# Altium project BIO26_hall_strip.PrjPcb
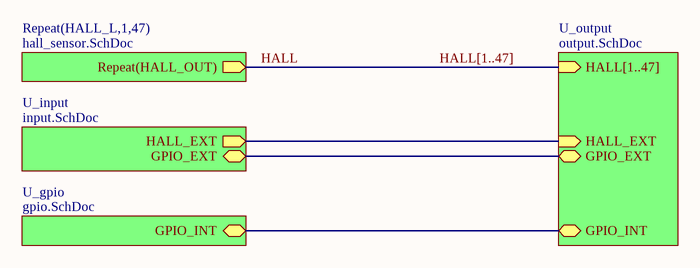
[diagram p0: hall_strip.SchDoc]
5 sheets, 100 parts. Net scope: hierarchical (ports join the sheet entries above them; power ports are global).
Board file: hall_strip.PcbDoc
Sheets:
  hall_strip.SchDoc
    HALL_L1 = hall_sensor.SchDoc
    HALL_L2 = hall_sensor.SchDoc
    HALL_L3 = hall_sensor.SchDoc
    HALL_L4 = hall_sensor.SchDoc
    HALL_L5 = hall_sensor.SchDoc
    HALL_L6 = hall_sensor.SchDoc
    HALL_L7 = hall_sensor.SchDoc
    HALL_L8 = hall_sensor.SchDoc
    HALL_L9 = hall_sensor.SchDoc
    HALL_L10 = hall_sensor.SchDoc
    HALL_L11 = hall_sensor.SchDoc
    HALL_L12 = hall_sensor.SchDoc
    HALL_L13 = hall_sensor.SchDoc
    HALL_L14 = hall_sensor.SchDoc
    HALL_L15 = hall_sensor.SchDoc
    HALL_L16 = hall_sensor.SchDoc
    HALL_L17 = hall_sensor.SchDoc
    HALL_L18 = hall_sensor.SchDoc
    HALL_L19 = hall_sensor.SchDoc
    HALL_L20 = hall_sensor.SchDoc
    HALL_L21 = hall_sensor.SchDoc
    HALL_L22 = hall_sensor.SchDoc
    HALL_L23 = hall_sensor.SchDoc
    HALL_L24 = hall_sensor.SchDoc
    HALL_L25 = hall_sensor.SchDoc
    HALL_L26 = hall_sensor.SchDoc
    HALL_L27 = hall_sensor.SchDoc
    HALL_L28 = hall_sensor.SchDoc
    HALL_L29 = hall_sensor.SchDoc
    HALL_L30 = hall_sensor.SchDoc
    HALL_L31 = hall_sensor.SchDoc
    HALL_L32 = hall_sensor.SchDoc
    HALL_L33 = hall_sensor.SchDoc
    HALL_L34 = hall_sensor.SchDoc
    HALL_L35 = hall_sensor.SchDoc
    HALL_L36 = hall_sensor.SchDoc
    HALL_L37 = hall_sensor.SchDoc
    HALL_L38 = hall_sensor.SchDoc
    HALL_L39 = hall_sensor.SchDoc
    HALL_L40 = hall_sensor.SchDoc
    HALL_L41 = hall_sensor.SchDoc
    HALL_L42 = hall_sensor.SchDoc
    HALL_L43 = hall_sensor.SchDoc
    HALL_L44 = hall_sensor.SchDoc
    HALL_L45 = hall_sensor.SchDoc
    HALL_L46 = hall_sensor.SchDoc
    HALL_L47 = hall_sensor.SchDoc
    U_output = output.SchDoc
    U_input = input.SchDoc
    U_gpio = gpio.SchDoc

## Sheet hall_strip.SchDoc
size A4

### Sub-sheets
Repeat(HALL_L,1,47) = hall_sensor.SchDoc: Repeat(HALL_OUT) (out)
U_gpio = gpio.SchDoc: GPIO_INT (bidir)
U_input = input.SchDoc: HALL_EXT (out), GPIO_EXT (bidir)
U_output = output.SchDoc: HALL[1..47] (in), GPIO_EXT (bidir), GPIO_INT (bidir), HALL_EXT (in)

### Nets
GPIO_EXT: sheet U_output/GPIO_EXT, sheet U_input/GPIO_EXT
GPIO_INT: sheet U_output/GPIO_INT, sheet U_gpio/GPIO_INT
HALL: sheet Repeat(HALL_L,1,47)/Repeat(HALL_OUT)
HALL_EXT: sheet U_output/HALL_EXT, sheet U_input/HALL_EXT

### Buses and harness runs
bus HALL[1..47] =  = sheet U_output/HALL[1..47]

## Sheet hall_sensor.SchDoc
size A4
Used 47 times, as channels HALL_L1, HALL_L2, HALL_L3, HALL_L4, HALL_L5, HALL_L6, HALL_L7, HALL_L8, HALL_L9, HALL_L10, HALL_L11, HALL_L12, HALL_L13, HALL_L14, HALL_L15, HALL_L16, HALL_L17, HALL_L18, HALL_L19, HALL_L20, HALL_L21, HALL_L22, HALL_L23, HALL_L24, HALL_L25, HALL_L26, HALL_L27, HALL_L28, HALL_L29, HALL_L30, HALL_L31, HALL_L32, HALL_L33, HALL_L34, HALL_L35, HALL_L36, HALL_L37, HALL_L38, HALL_L39, HALL_L40, HALL_L41, HALL_L42, HALL_L43, HALL_L44, HALL_L45, HALL_L46, HALL_L47. Parts and nets are listed once, with the designators drawn on the sheet.
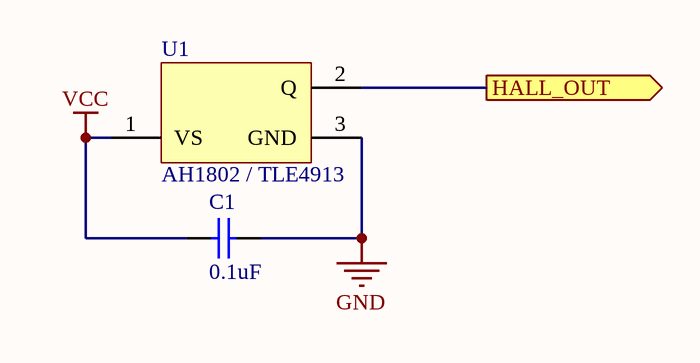
[diagram p1: hall_sensor.SchDoc]

### Parts
C1  0.1uF  [CAPC1608X87X35NL15T15]
U1  AH1802 / TLE4913  [INF-PG-SC59_M]

### Ports
HALL_OUT (out)

### Nets
GND: C1.2 U1.3(GND)
VCC: C1.1 U1.1(VS)
HALL_OUT: U1.2(Q) ; port HALL_OUT

### Channels
HALL_L1: designators end in _HALL_L1; ports HALL_OUT=HALL1
HALL_L2: designators end in _HALL_L2; ports HALL_OUT=HALL1
HALL_L3: designators end in _HALL_L3; ports HALL_OUT=HALL1
HALL_L4: designators end in _HALL_L4; ports HALL_OUT=HALL1
HALL_L5: designators end in _HALL_L5; ports HALL_OUT=HALL1
HALL_L6: designators end in _HALL_L6; ports HALL_OUT=HALL1
HALL_L7: designators end in _HALL_L7; ports HALL_OUT=HALL1
HALL_L8: designators end in _HALL_L8; ports HALL_OUT=HALL1
HALL_L9: designators end in _HALL_L9; ports HALL_OUT=HALL1
HALL_L10: designators end in _HALL_L10; ports HALL_OUT=HALL1
HALL_L11: designators end in _HALL_L11; ports HALL_OUT=HALL1
HALL_L12: designators end in _HALL_L12; ports HALL_OUT=HALL1
HALL_L13: designators end in _HALL_L13; ports HALL_OUT=HALL1
HALL_L14: designators end in _HALL_L14; ports HALL_OUT=HALL1
HALL_L15: designators end in _HALL_L15; ports HALL_OUT=HALL1
HALL_L16: designators end in _HALL_L16; ports HALL_OUT=HALL1
HALL_L17: designators end in _HALL_L17; ports HALL_OUT=HALL1
HALL_L18: designators end in _HALL_L18; ports HALL_OUT=HALL1
HALL_L19: designators end in _HALL_L19; ports HALL_OUT=HALL1
HALL_L20: designators end in _HALL_L20; ports HALL_OUT=HALL1
HALL_L21: designators end in _HALL_L21; ports HALL_OUT=HALL1
HALL_L22: designators end in _HALL_L22; ports HALL_OUT=HALL1
HALL_L23: designators end in _HALL_L23; ports HALL_OUT=HALL1
HALL_L24: designators end in _HALL_L24; ports HALL_OUT=HALL1
HALL_L25: designators end in _HALL_L25; ports HALL_OUT=HALL1
HALL_L26: designators end in _HALL_L26; ports HALL_OUT=HALL1
HALL_L27: designators end in _HALL_L27; ports HALL_OUT=HALL1
HALL_L28: designators end in _HALL_L28; ports HALL_OUT=HALL1
HALL_L29: designators end in _HALL_L29; ports HALL_OUT=HALL1
HALL_L30: designators end in _HALL_L30; ports HALL_OUT=HALL1
HALL_L31: designators end in _HALL_L31; ports HALL_OUT=HALL1
HALL_L32: designators end in _HALL_L32; ports HALL_OUT=HALL1
HALL_L33: designators end in _HALL_L33; ports HALL_OUT=HALL1
HALL_L34: designators end in _HALL_L34; ports HALL_OUT=HALL1
HALL_L35: designators end in _HALL_L35; ports HALL_OUT=HALL1
HALL_L36: designators end in _HALL_L36; ports HALL_OUT=HALL1
HALL_L37: designators end in _HALL_L37; ports HALL_OUT=HALL1
HALL_L38: designators end in _HALL_L38; ports HALL_OUT=HALL1
HALL_L39: designators end in _HALL_L39; ports HALL_OUT=HALL1
HALL_L40: designators end in _HALL_L40; ports HALL_OUT=HALL1
HALL_L41: designators end in _HALL_L41; ports HALL_OUT=HALL1
HALL_L42: designators end in _HALL_L42; ports HALL_OUT=HALL1
HALL_L43: designators end in _HALL_L43; ports HALL_OUT=HALL1
HALL_L44: designators end in _HALL_L44; ports HALL_OUT=HALL1
HALL_L45: designators end in _HALL_L45; ports HALL_OUT=HALL1
HALL_L46: designators end in _HALL_L46; ports HALL_OUT=HALL1
HALL_L47: designators end in _HALL_L47; ports HALL_OUT=HALL1

### Library data of the parts
C1 = CMP-2006-03300-1: Part Number: C0603X104K5RACTU; Manufacturer: Kemet
U1 = CMP-1148-00005-1: Low Power Hall Switch, PG-SC59, Reel, Green; Manufacturer: Infineon; Direction Detection: FALSE; Green: TRUE; Interface: open collector; Bhyst (25degreesC) max: 0.8Â mT; Target Application: Consumer, Mobile (Low power); Bop (25degreesC) min: 3.5Â mT; Brp (25degreesC) typ: 2.7Â mT; ComponentLink3Description: Package Specification; DatasheetVersion: Rev. 2.2; ComponentLink1Description: Manufacturer URL; PackageVersion: Mar-08; PackageReference: PG-SC59; PartNumber: AH1802; Type: Omnipolar Switch; ComponentLink2Description: Datasheet; Packing: Reel; Mounting Technology: Surface Mount; PackageDescription: 3-Pin Semiconductor Package, 3 x 1.53 mm Body, 0.95 mm Pitch; ComponentLink2URL: http://www.infineon.com/dgdl/TLE4913_Data_Sheet_2006_03_16.pdf?folderId=db3a30431689f4420116a096e1db033e&fileId=db3a304316f66ee80117544449e10647; Chopped Hall Technology: TRUE; ComponentLink1URL: http://www.infineon.com/; ComponentLink3URL: http://www.infineon.com/dgdl/SC59-Package_Overview.pdf?folderId=db3a30431936bc4b01194dc0d34440b0&fileId=db3a30431936bc4b01194dd1aa1d40cf

## Sheet output.SchDoc
size A4
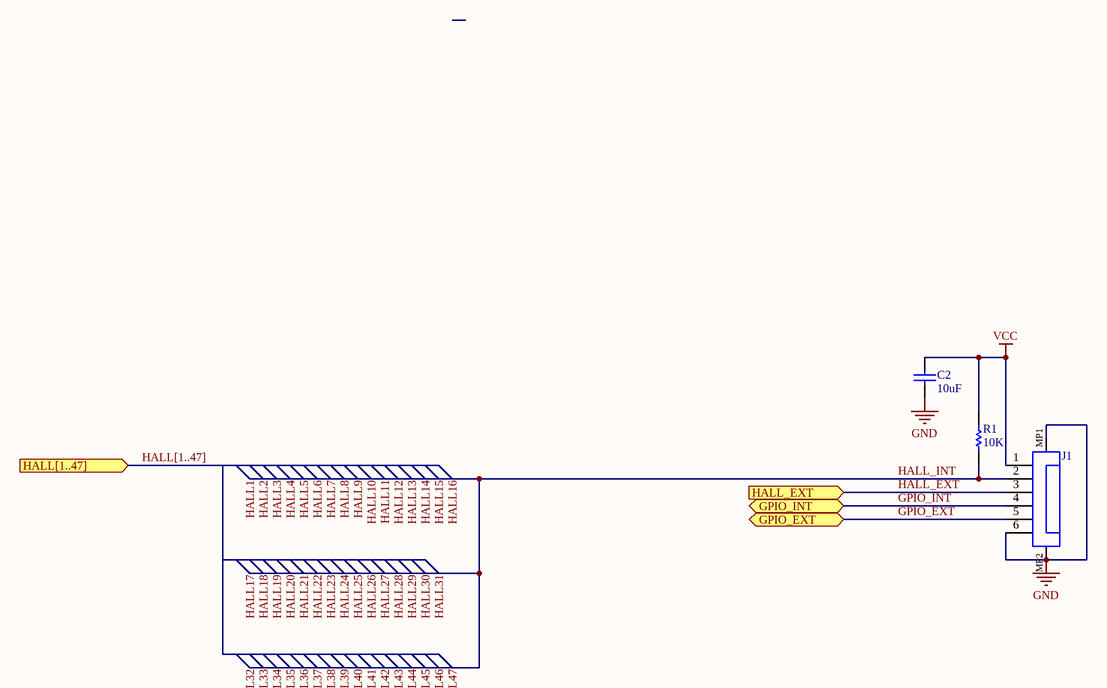
[diagram p2: output.SchDoc]

### Parts
C2  10uF  [CAPC2013X140X50LL20T25]
J1  68610614422  [68610614422]  (value not drawn)
R1  10K  [RESC1608X55X30LL15T15]

### Ports
GPIO_EXT (bidir), GPIO_INT (bidir), HALL[1..47] (in), HALL_EXT (in)

### Nets
GND: C2.1 J1.6 J1.MP1 J1.MP2
VCC: C2.2 J1.1 R1.2
GPIO_EXT: J1.5 ; port GPIO_EXT
GPIO_INT: J1.4 ; port GPIO_INT
HALL1: J1.2 R1.1  [also labelled HALL10, HALL11, HALL12, HALL13, HALL14, HALL15, HALL16, HALL17, HALL18, HALL19, HALL2, HALL20, HALL21, HALL22, HALL23, HALL24, HALL25, HALL26, HALL27, HALL28, HALL29, HALL3, HALL30, HALL31, HALL32, HALL33, HALL34, HALL35, HALL36, HALL37, HALL38, HALL39, HALL4, HALL40, HALL41, HALL42, HALL43, HALL44, HALL45, HALL46, HALL47, HALL5, HALL6, HALL7, HALL8, HALL9, HALL_INT]
HALL_EXT: J1.3 ; port HALL_EXT

### Buses and harness runs
bus HALL[1..47] = port HALL[1..47]

### Library data of the parts
C2 = CMP-2007-03243-1: Part Number: C0805C106K8PACTU; Manufacturer: Kemet
J1 = CMP-1502-01454-1: SMT ZIF Connectors WR-FPC, Horizontal, Bottom Contact, pitch 1 mm, 6 pins; Manufacturer: Wurth Elektronik; Contact Resistance: 20mOhm; Rated Current: 1A; Pitch: 1mm; Withstanding Voltage: 500VAC; Working Voltage: 125VAC; Pin Number: 6; Operating Temperature: -25to85degC; Packaging: TapeandReel; Contact Design: BottomContact; Manufacturer URL: http://www.we-online.de; Part Number: 68610614422; Publisher: WurthElektronik; Package Reference: 68610614422; Datasheet URL: https://katalog.we-online.de/em/datasheet/68610614422.pdf; Mounting Technology: SMT; Orientation: Horizontal; System: Connector
R1 = CMP-2000-00181-1: Part Number: ERJ-3EKF1002V; Manufacturer: Panasonic

## Sheet input.SchDoc
size A4
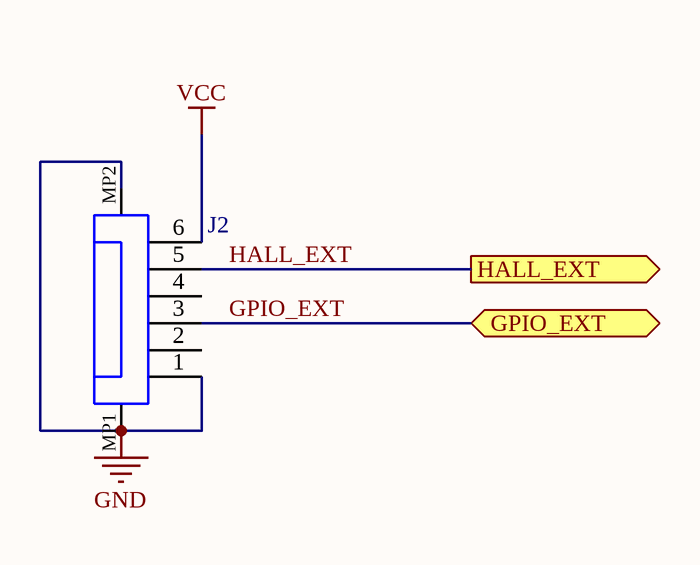
[diagram p3: input.SchDoc]

### Parts
J2  68610614422  [68610614422]  (value not drawn)

### Ports
GPIO_EXT (bidir), HALL_EXT (out)

### Nets
GND: J2.1 J2.MP1 J2.MP2
VCC: J2.6
GPIO_EXT: J2.3 ; port GPIO_EXT
HALL_EXT: J2.5 ; port HALL_EXT

Not connected (* = marked no-connect by the designer): J2 2 4

### Library data of the parts
J2 = CMP-1502-01454-1: as J1 on sheet output; Operating Temperature: -25to85degC; Packaging: TapeandReel; Contact Design: BottomContact; Manufacturer URL: http://www.we-online.de; Part Number: 68610614422; Publisher: WurthElektronik; Package Reference: 68610614422; Datasheet URL: https://katalog.we-online.de/em/datasheet/68610614422.pdf; Mounting Technology: SMT; Orientation: Horizontal; System: Connector

## Sheet gpio.SchDoc
size A4
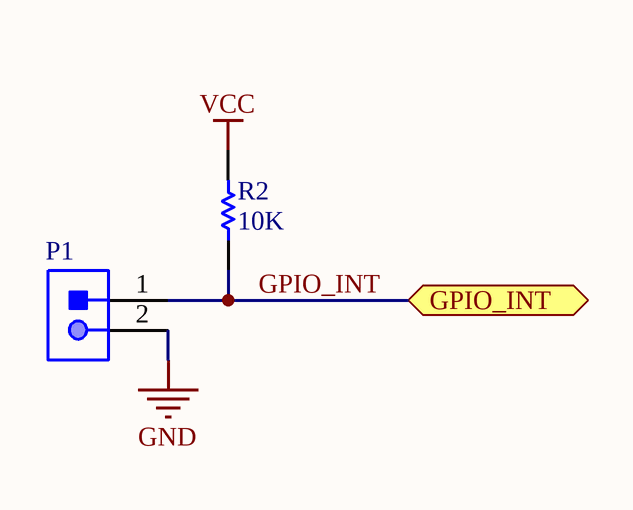
[diagram p4: gpio.SchDoc]

### Parts
P1  61300211021  [61300211021]  (value not drawn)
R2  10K  [RESC1608X55X30LL15T15]

### Ports
GPIO_INT (bidir)

### Nets
GND: P1.2
VCC: R2.2
GPIO_INT: P1.1 R2.1 ; port GPIO_INT

### Library data of the parts
P1 = CMP-1502-01059-1: THT Angled Pin Header WR-PHD, Pitch 2.54 mm, Single Row, 2 pins; Manufacturer: Wurth Elektronik; Withstanding Voltage: 500VAC; Gender: Male; Pitch: 2.54mm; Pin Number: 2; Rated Current: 3A; Contact Resistance: 20mOhm; Working Voltage: 250VAC; Packaging: Bag; Mounting Technology: THT; Part Number: 61300211021; Manufacturer URL: http://www.we-online.de; Operating Temperature: -40to105degC; Row Number: Single; Publisher: WurthElektronik; Orientation: Angled; Datasheet URL: https://katalog.we-online.de/em/datasheet/6130xx11021.pdf; Package Reference: 61300211021
R2 = CMP-2000-00181-1: as R1 on sheet output

## Nets that join several sheets
GND: HALL_L1 (C1_HALL_L1.2 U1_HALL_L1.3), HALL_L2 (C1_HALL_L2.2 U1_HALL_L2.3), HALL_L3 (C1_HALL_L3.2 U1_HALL_L3.3), HALL_L4 (C1_HALL_L4.2 U1_HALL_L4.3), HALL_L5 (C1_HALL_L5.2 U1_HALL_L5.3), HALL_L6 (C1_HALL_L6.2 U1_HALL_L6.3), HALL_L7 (C1_HALL_L7.2 U1_HALL_L7.3), HALL_L8 (C1_HALL_L8.2 U1_HALL_L8.3), HALL_L9 (C1_HALL_L9.2 U1_HALL_L9.3), HALL_L10 (C1_HALL_L10.2 U1_HALL_L10.3), HALL_L11 (C1_HALL_L11.2 U1_HALL_L11.3), HALL_L12 (C1_HALL_L12.2 U1_HALL_L12.3), HALL_L13 (C1_HALL_L13.2 U1_HALL_L13.3), HALL_L14 (C1_HALL_L14.2 U1_HALL_L14.3), HALL_L15 (C1_HALL_L15.2 U1_HALL_L15.3), HALL_L16 (C1_HALL_L16.2 U1_HALL_L16.3), HALL_L17 (C1_HALL_L17.2 U1_HALL_L17.3), HALL_L18 (C1_HALL_L18.2 U1_HALL_L18.3), HALL_L19 (C1_HALL_L19.2 U1_HALL_L19.3), HALL_L20 (C1_HALL_L20.2 U1_HALL_L20.3), HALL_L21 (C1_HALL_L21.2 U1_HALL_L21.3), HALL_L22 (C1_HALL_L22.2 U1_HALL_L22.3), HALL_L23 (C1_HALL_L23.2 U1_HALL_L23.3), HALL_L24 (C1_HALL_L24.2 U1_HALL_L24.3), HALL_L25 (C1_HALL_L25.2 U1_HALL_L25.3), HALL_L26 (C1_HALL_L26.2 U1_HALL_L26.3), HALL_L27 (C1_HALL_L27.2 U1_HALL_L27.3), HALL_L28 (C1_HALL_L28.2 U1_HALL_L28.3), HALL_L29 (C1_HALL_L29.2 U1_HALL_L29.3), HALL_L30 (C1_HALL_L30.2 U1_HALL_L30.3), HALL_L31 (C1_HALL_L31.2 U1_HALL_L31.3), HALL_L32 (C1_HALL_L32.2 U1_HALL_L32.3), HALL_L33 (C1_HALL_L33.2 U1_HALL_L33.3), HALL_L34 (C1_HALL_L34.2 U1_HALL_L34.3), HALL_L35 (C1_HALL_L35.2 U1_HALL_L35.3), HALL_L36 (C1_HALL_L36.2 U1_HALL_L36.3), HALL_L37 (C1_HALL_L37.2 U1_HALL_L37.3), HALL_L38 (C1_HALL_L38.2 U1_HALL_L38.3), HALL_L39 (C1_HALL_L39.2 U1_HALL_L39.3), HALL_L40 (C1_HALL_L40.2 U1_HALL_L40.3), HALL_L41 (C1_HALL_L41.2 U1_HALL_L41.3), HALL_L42 (C1_HALL_L42.2 U1_HALL_L42.3), HALL_L43 (C1_HALL_L43.2 U1_HALL_L43.3), HALL_L44 (C1_HALL_L44.2 U1_HALL_L44.3), HALL_L45 (C1_HALL_L45.2 U1_HALL_L45.3), HALL_L46 (C1_HALL_L46.2 U1_HALL_L46.3), HALL_L47 (C1_HALL_L47.2 U1_HALL_L47.3), output (C2.1 J1.6 J1.MP1 J1.MP2), input (J2.1 J2.MP1 J2.MP2), gpio (P1.2)
VCC: HALL_L1 (C1_HALL_L1.1 U1_HALL_L1.1), HALL_L2 (C1_HALL_L2.1 U1_HALL_L2.1), HALL_L3 (C1_HALL_L3.1 U1_HALL_L3.1), HALL_L4 (C1_HALL_L4.1 U1_HALL_L4.1), HALL_L5 (C1_HALL_L5.1 U1_HALL_L5.1), HALL_L6 (C1_HALL_L6.1 U1_HALL_L6.1), HALL_L7 (C1_HALL_L7.1 U1_HALL_L7.1), HALL_L8 (C1_HALL_L8.1 U1_HALL_L8.1), HALL_L9 (C1_HALL_L9.1 U1_HALL_L9.1), HALL_L10 (C1_HALL_L10.1 U1_HALL_L10.1), HALL_L11 (C1_HALL_L11.1 U1_HALL_L11.1), HALL_L12 (C1_HALL_L12.1 U1_HALL_L12.1), HALL_L13 (C1_HALL_L13.1 U1_HALL_L13.1), HALL_L14 (C1_HALL_L14.1 U1_HALL_L14.1), HALL_L15 (C1_HALL_L15.1 U1_HALL_L15.1), HALL_L16 (C1_HALL_L16.1 U1_HALL_L16.1), HALL_L17 (C1_HALL_L17.1 U1_HALL_L17.1), HALL_L18 (C1_HALL_L18.1 U1_HALL_L18.1), HALL_L19 (C1_HALL_L19.1 U1_HALL_L19.1), HALL_L20 (C1_HALL_L20.1 U1_HALL_L20.1), HALL_L21 (C1_HALL_L21.1 U1_HALL_L21.1), HALL_L22 (C1_HALL_L22.1 U1_HALL_L22.1), HALL_L23 (C1_HALL_L23.1 U1_HALL_L23.1), HALL_L24 (C1_HALL_L24.1 U1_HALL_L24.1), HALL_L25 (C1_HALL_L25.1 U1_HALL_L25.1), HALL_L26 (C1_HALL_L26.1 U1_HALL_L26.1), HALL_L27 (C1_HALL_L27.1 U1_HALL_L27.1), HALL_L28 (C1_HALL_L28.1 U1_HALL_L28.1), HALL_L29 (C1_HALL_L29.1 U1_HALL_L29.1), HALL_L30 (C1_HALL_L30.1 U1_HALL_L30.1), HALL_L31 (C1_HALL_L31.1 U1_HALL_L31.1), HALL_L32 (C1_HALL_L32.1 U1_HALL_L32.1), HALL_L33 (C1_HALL_L33.1 U1_HALL_L33.1), HALL_L34 (C1_HALL_L34.1 U1_HALL_L34.1), HALL_L35 (C1_HALL_L35.1 U1_HALL_L35.1), HALL_L36 (C1_HALL_L36.1 U1_HALL_L36.1), HALL_L37 (C1_HALL_L37.1 U1_HALL_L37.1), HALL_L38 (C1_HALL_L38.1 U1_HALL_L38.1), HALL_L39 (C1_HALL_L39.1 U1_HALL_L39.1), HALL_L40 (C1_HALL_L40.1 U1_HALL_L40.1), HALL_L41 (C1_HALL_L41.1 U1_HALL_L41.1), HALL_L42 (C1_HALL_L42.1 U1_HALL_L42.1), HALL_L43 (C1_HALL_L43.1 U1_HALL_L43.1), HALL_L44 (C1_HALL_L44.1 U1_HALL_L44.1), HALL_L45 (C1_HALL_L45.1 U1_HALL_L45.1), HALL_L46 (C1_HALL_L46.1 U1_HALL_L46.1), HALL_L47 (C1_HALL_L47.1 U1_HALL_L47.1), output (C2.2 J1.1 R1.2), input (J2.6), gpio (R2.2)
GPIO_EXT: output (J1.5), input (J2.3)
GPIO_INT: output (J1.4), gpio (P1.1 R2.1)
HALL1: HALL_L1 (U1_HALL_L1.2), HALL_L2 (U1_HALL_L2.2), HALL_L3 (U1_HALL_L3.2), HALL_L4 (U1_HALL_L4.2), HALL_L5 (U1_HALL_L5.2), HALL_L6 (U1_HALL_L6.2), HALL_L7 (U1_HALL_L7.2), HALL_L8 (U1_HALL_L8.2), HALL_L9 (U1_HALL_L9.2), HALL_L10 (U1_HALL_L10.2), HALL_L11 (U1_HALL_L11.2), HALL_L12 (U1_HALL_L12.2), HALL_L13 (U1_HALL_L13.2), HALL_L14 (U1_HALL_L14.2), HALL_L15 (U1_HALL_L15.2), HALL_L16 (U1_HALL_L16.2), HALL_L17 (U1_HALL_L17.2), HALL_L18 (U1_HALL_L18.2), HALL_L19 (U1_HALL_L19.2), HALL_L20 (U1_HALL_L20.2), HALL_L21 (U1_HALL_L21.2), HALL_L22 (U1_HALL_L22.2), HALL_L23 (U1_HALL_L23.2), HALL_L24 (U1_HALL_L24.2), HALL_L25 (U1_HALL_L25.2), HALL_L26 (U1_HALL_L26.2), HALL_L27 (U1_HALL_L27.2), HALL_L28 (U1_HALL_L28.2), HALL_L29 (U1_HALL_L29.2), HALL_L30 (U1_HALL_L30.2), HALL_L31 (U1_HALL_L31.2), HALL_L32 (U1_HALL_L32.2), HALL_L33 (U1_HALL_L33.2), HALL_L34 (U1_HALL_L34.2), HALL_L35 (U1_HALL_L35.2), HALL_L36 (U1_HALL_L36.2), HALL_L37 (U1_HALL_L37.2), HALL_L38 (U1_HALL_L38.2), HALL_L39 (U1_HALL_L39.2), HALL_L40 (U1_HALL_L40.2), HALL_L41 (U1_HALL_L41.2), HALL_L42 (U1_HALL_L42.2), HALL_L43 (U1_HALL_L43.2), HALL_L44 (U1_HALL_L44.2), HALL_L45 (U1_HALL_L45.2), HALL_L46 (U1_HALL_L46.2), HALL_L47 (U1_HALL_L47.2), output (J1.2 R1.1)
HALL_EXT: output (J1.3), input (J2.5)